# Altium schematic sheet SH6 - CAN.SchDoc: CAN Transcievers
size B; CheckedBy: Lance Bantoto; DrawnBy: Kyle Hong; Engineer: Kyle Hong; Organization: UW Robotics; Address1: 200 University Avenue; Address2: Waterloo; Address3: Ontario; Address4: Canada N2L 3G6; Revision: 2; SheetNumber: 7; SheetTotal: 8
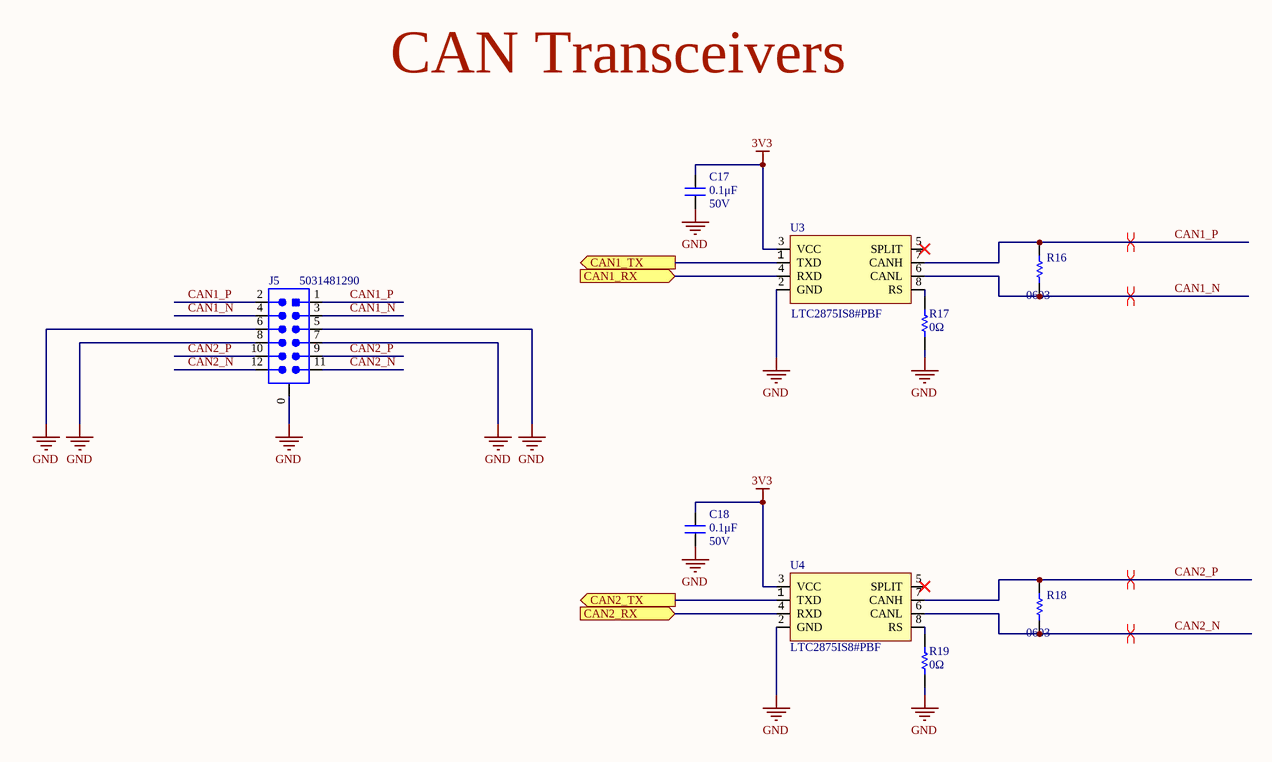
[diagram p0: SH6 - CAN.SchDoc]

## Parts
C17  value 0.1μF  Voltage Rating: 50V  [CAP0603]  (hidden comment: CAP_0.1uF_50V_0603)
C18  value 0.1μF  Voltage Rating: 50V  [CAP0603]  (hidden comment: CAP_0.1uF_50V_0603)
J5  Manufacturer Part Number 1: 5031481290  [MOLEX-5031481290]  (hidden comment: CON_6x2M_SM_RA)
R16  Package/Footprint: 0603  [RESC0603]  (hidden comment: RES_120Ω_0603_5%_HP)
R17  value 0Ω  [RESC0603]  (hidden comment: RES_0Ω_0603)
R18  Package/Footprint: 0603  [RESC0603]  (hidden comment: RES_120Ω_0603_5%_HP)
R19  value 0Ω  [RESC0603]  (hidden comment: RES_0Ω_0603)
U3  Manufacturer Part Number 1: LTC2875IS8#PBF  [LT-S8_N]  (hidden comment: LTC2875)
U4  Manufacturer Part Number 1: LTC2875IS8#PBF  [LT-S8_N]  (hidden comment: LTC2875)

## Ports
CAN1_RX (in), CAN1_TX (out), CAN2_RX (in), CAN2_TX (out)

## Nets
3V3: C17.1 C18.1 U3.3(VCC) U4.3(VCC)
GND: C17.2 C18.2 J5.0 J5.5 J5.6 J5.7 J5.8 R17.1 R19.1 U3.2(GND) U4.2(GND)
CAN1_N: J5.3 J5.4 R16.1 U3.6(CANL)
CAN1_P: J5.1 J5.2 R16.2 U3.7(CANH)
CAN1_RX: U3.4(RXD) ; port CAN1_RX
CAN1_TX: U3.1(TXD) ; port CAN1_TX
CAN2_N: J5.11 J5.12 R18.1 U4.6(CANL)
CAN2_P: J5.9 J5.10 R18.2 U4.7(CANH)
CAN2_RX: U4.4(RXD) ; port CAN2_RX
CAN2_TX: U4.1(TXD) ; port CAN2_TX
NetR17_2: R17.2 U3.8(RS)
NetR19_2: R19.2 U4.8(RS)

Not connected (* = marked no-connect by the designer): U3 5(SPLIT)*; U4 5(SPLIT)*

## Layout directives
differential pair: CAN1_N, CAN1_P, CAN2_N, CAN2_P

## Notes on the sheet
- CAN Transceivers
- Title:
- Project:
- Date:
- Rev:
- Reviewer:
- Engineer:
- Sheet:
- of

## Library data of the parts
C17 C18 = CAP_0.1uF_50V_0603: CAP CER 0.1UF 50V X7R 0603; Manufacturer Part Number 1: CC0603KRX7R9BB104; Manufacturer 1: Yageo; Package/Footprint: 0603; Supplier Part Number 1: 311-1344-1-ND; Supplier 1: Digi-Key; Dielectric: X7R; Mounting Type: SMD
J5 = CON_6x2M_SM_RA: CONN HEADER SMD RIGHT ANGLE 1.5MM PITCH; Manufacturer 1: Molex; Voltage Rating: 100V; Current Rating: 1A; Supplier 1: Digi-Key; Orientation: Right Angle; Pitch: 1.5mm; Supplier Part Number 1: WM14476CT-ND; Mounting Type: SMD; Package/Footprint: SMD
R16 R18 = RES_120Ω_0603_5%_HP: RES 120 OHM 5% 1/4W 0603; Manufacturer 1: Rohm; Manufacturer Part Number 1: ESR03EZPJ121; Supplier Part Number 1: RHM120DCT-ND; Supplier 1: Digi-Key; Mounting Type: SMD
R17 R19 = RES_0Ω_0603: RES 0 OHM JUMPER 1/10W 0603; Manufacturer 1: Yageo; Manufacturer Part Number 1: RC0603JR-070RL; Package/Footprint: 0603; Supplier Part Number 1: 311-0.0GRCT-ND; Supplier 1: Digi-Key; Mounting Type: SMD
U3 U4 = LTC2875: IC TXRX CAN 4MBPS 8SO; Manufacturer 1: Linear Technologies; Package/Footprint: 8-SOIC; Supplier Part Number 1: LTC2875IS8#PBF-ND; Supplier 1: Digi-Key; Mounting Type: SMD; LCSC Part #: C117076